# Altium schematic sheet SENSORS.SchDoc
size A4
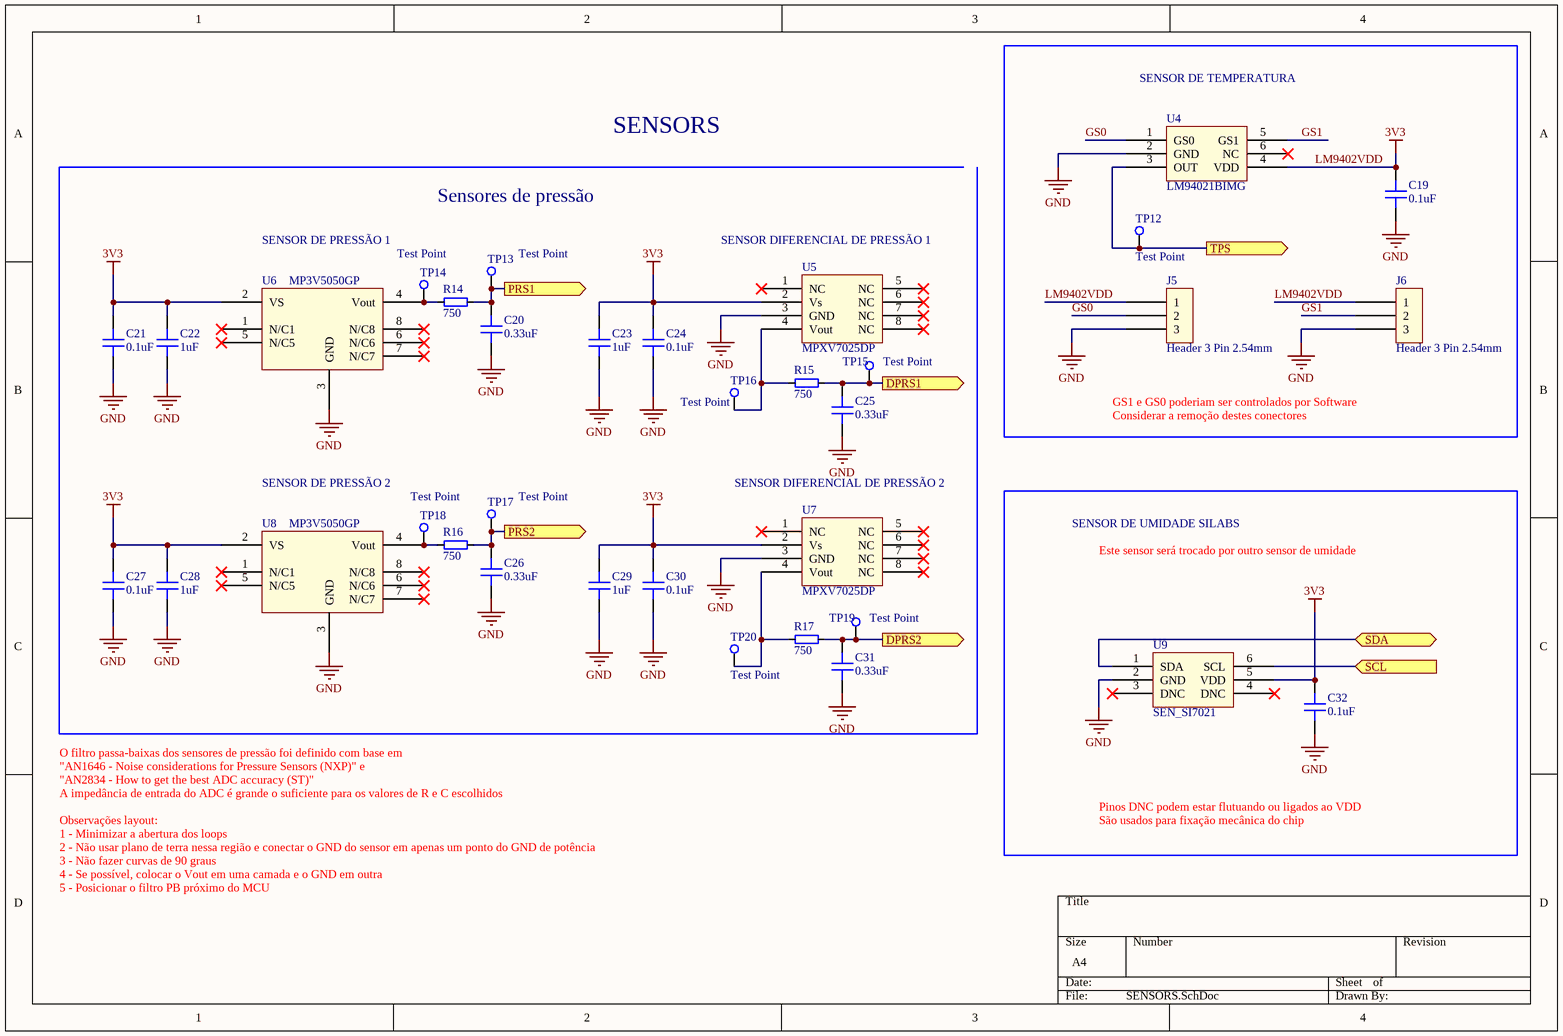
[diagram p0: SENSORS.SchDoc]

## Parts
C19  0.1uF  [C_0805]
C20  0.33uF  [C_0805]
C21  0.1uF  [C_0805]
C22  1uF  [C_0805]
C23  1uF  [C_0805]
C24  0.1uF  [C_0805]
C25  0.33uF  [C_0805]
C26  0.33uF  [C_0805]
C27  0.1uF  [C_0805]
C28  1uF  [C_0805]
C29  1uF  [C_0805]
C30  0.1uF  [C_0805]
C31  0.33uF  [C_0805]
C32  0.1uF  [C_0805]
J5  Header 3 Pin 2.54mm  [Header 3 Pin 2.54mm]
J6  Header 3 Pin 2.54mm  [Header 3 Pin 2.54mm]
R14  750  [R_0805]
R15  750  [R_0805]
R16  750  [R_0805]
R17  750  [R_0805]
TP12  Test Point  [Test_Point]
TP13  Test Point  [Test_Point]
TP14  Test Point  [Test_Point]
TP15  Test Point  [Test_Point]
TP16  Test Point  [Test_Point]
TP17  Test Point  [Test_Point]
TP18  Test Point  [Test_Point]
TP19  Test Point  [Test_Point]
TP20  Test Point  [Test_Point]
U4  LM94021BIMG  [LM94021BIMG]
U5  MPXV7025DP  [MPXV7025DP]
U6  MP3V5050GP  [MP3V5050GP]
U7  MPXV7025DP  [MPXV7025DP]
U8  MP3V5050GP  [MP3V5050GP]
U9  SEN_SI7021  [SI7021_6DFN]

## Ports
DPRS1 (out), DPRS2 (out), PRS1 (out), PRS2 (out), SCL (in), SDA (bidir), TPS (out)

## Nets
GND: C19.1 C20.1 C21.1 C22.1 C23.1 C24.1 C25.1 C26.1 C27.1 C28.1 C29.1 C30.1 C31.1 C32.1 J5.3 J6.3 U4.2(GND) U5.3(GND) U6.3(GND) U7.3(GND) U8.3(GND) U9.2(GND)
LM9402VDD: C19.2 C21.2 C22.2 C23.2 C24.2 C27.2 C28.2 C29.2 C30.2 C32.2 J5.1 J6.1 U4.4(VDD) U5.2(Vs) U6.2(VS) U7.2(Vs) U8.2(VS) U9.5(VDD)  [also labelled 3V3]
DPRS1: C25.2 R15.2 TP15.1(TP) ; port DPRS1
DPRS2: C31.2 R17.2 TP19.1(TP) ; port DPRS2
GS0: J5.2 U4.1(GS0)
GS1: J6.2 U4.5(GS1)
PRS1: C20.2 R14.2 TP13.1(TP) ; port PRS1
PRS2: C26.2 R16.2 TP17.1(TP) ; port PRS2
SCL: U9.6(SCL) ; port SCL
SDA: U9.1(SDA) ; port SDA
TPS: TP12.1(TP) U4.3(OUT) ; port TPS
NetR14_1: R14.1 TP14.1(TP) U6.4(Vout)
NetR15_1: R15.1 TP16.1(TP) U5.4(Vout)
NetR16_1: R16.1 TP18.1(TP) U8.4(Vout)
NetR17_1: R17.1 TP20.1(TP) U7.4(Vout)

Not connected (* = marked no-connect by the designer): U4 6(NC)*; U5 1(NC)* 5(NC)* 6(NC)* 7(NC)* 8(NC)*; U6 1(N/C1)* 5(N/C5)* 6(N/C6)* 7(N/C7)* 8(N/C8)*; U7 1(NC)* 5(NC)* 6(NC)* 7(NC)* 8(NC)*; U8 1(N/C1)* 5(N/C5)* 6(N/C6)* 7(N/C7)* 8(N/C8)*; U9 3(DNC)* 4(DNC)*

## Notes on the sheet
- SENSOR DE TEMPERATURA
- SENSORS
- SENSOR DE PRESSÃO 1
- Sensores de pressão
- (near U5) SENSOR DIFERENCIAL DE PRESSÃO 1
- GS1 e GS0 poderiam ser controlados por Software
- Considerar a remoção destes conectores
- SENSOR DE PRESSÃO 2
- SENSOR DIFERENCIAL DE PRESSÃO 2
- SENSOR DE UMIDADE SILABS
- Este sensor será trocado por outro sensor de umidade
- O filtro passa-baixas dos sensores de pressão foi definido com base em
- "AN1646 - Noise considerations for Pressure Sensors (NXP)" e
- "AN2834 - How to get the best ADC accuracy (ST)"
- A impedância de entrada do ADC é grande o suficiente para os valores de R e C escolhidos
- Observações layout:
- 1 - Minimizar a abertura dos loops
- 2 - Não usar plano de terra nessa região e conectar o GND do sensor em apenas um ponto do GND de potência
- Pinos DNC podem estar flutuando ou ligados ao VDD
- São usados para fixação mecânica do chip
- 3 - Não fazer curvas de 90 graus
- 4 - Se possível, colocar o Vout em uma camada e o GND em outra
- 5 - Posicionar o filtro PB próximo do MCU

## Library data of the parts
C19 C21 C24 C27 C30 C32 = C_0805_C0805C104K5RAC7411: SMD/SMT 50V 0.1uF X7R 0805 10% Ceramic; Manufacturer: KEMET; Value: 0.1uF; Voltage: 50V; Datasheet: https://www.mouser.in/datasheet/2/212/KEM_C1002_X7R_SMD-1102033.pdf; Supplier: https://www.mouser.in/ProductDetail/KEMET/C0805C104K5RAC7411?qs=sGAEpiMZZMukHu%252BjC5l7YUy%2FB4dg%2FhTABr7B0xlsxU8%3D; Temperature: -55 to +125ºC; Part Number: C0805C104K5RAC7411
C20 C25 C26 C31 = C_0805_C0805C334K5RECTU: SMD/SMT 50V 0.33uF X7R 0805 10%; Manufacturer: KEMET; Value: 0.33uF; Voltage: 50V; Datasheet: https://br.mouser.com/datasheet/2/212/KEM_C1090_X7R_ESD-1103328.pdf; Supplier: https://br.mouser.com/ProductDetail/KEMET/C0805C334K5RECTU?qs=sGAEpiMZZMukHu%252BjC5l7YW4TDpT9cCWZSWBJF89q8JI%3D; Temperature: -55 to +125ºC; Part Number: C0805C334K5RECTU
C22 C23 C28 C29 = C_0805_UMF212B7105KGHT: SMD/SMT 0805 50V 1uF 10% AEC-Q200 Ceramic; Manufacturer: Taiyo Yuden; Value: 1uF; Voltage: 50V; Datasheet: https://www.mouser.in/datasheet/2/396/taiyo_yuden_07182019_MLCC_AECQ200_Grade_1_X7R_data-1622917.pdf; Supplier: https://www.mouser.in/ProductDetail/Taiyo-Yuden/UMF212B7105KGHT?qs=sGAEpiMZZMukHu%252BjC5l7YbZJogKwR3uAsvk8LFV85oI%3D; Temperature: -55 to 125ºC; Part Number: UMF212B7105KGHT
R14-R17 = R_0805_ERJ-ERJ-6GEYJ751V: SMD 0805 750 OHM 5% AEC-Q200; Manufacturer: Panasonic; Voltage: 150V; Value: 750; Supplier: https://br.mouser.com/ProductDetail/Panasonic/ERJ-6GEYJ751V?qs=%2Fha2pyFaduiXHwl36i8QX0hu09VIkjbS%252B7Un%252BBpYHaXMOPUjNj5d7Q%3D%3D; Datasheet: https://br.mouser.com/datasheet/2/315/AOA0000C301-1488782.pdf; Temperature: -55 to +155ºC; Part Number: ERJ-6GEYJ751V
U4 = SEN_LM94021BIMG: IC TEMP SENSOR MULTI-GAIN SC70-5; Part Number: LM94021BIMG; Datasheet: http://www.ti.com/general/docs/suppproductinfo.tsp?distId=26&gotoUrl=http%3A%2F%2Fwww.ti.com%2Flit%2Fgpn%2Flm94021; Supplier: https://br.mouser.com/ProductDetail/Texas-Instruments/LM94021BIMG-NOPB?qs=QbsRYf82W3Gamc2uDn7DIw%3D%3D
U5 U7 = SEN_MPXV7025DP: -25 to 25 kPa Differential Pressure Sensor DUAL PORT 8-SOP; Part Number: MPXV7025DP; Datasheet: https://br.mouser.com/datasheet/2/302/MPXV7025-1127333.pdf; Supplier: https://br.mouser.com/ProductDetail/NXP-Semiconductors/MPXV7025DP?qs=r8OyiFxb6ReyFzMvnwyjmg%3D%3D
U6 U8 = SEN_MP3V5050GP: IC PRESSURE SENSOR 8-SOP 7PSI; Part Number: MP3V5050GP; Datasheet: https://br.mouser.com/datasheet/2/302/MP3V5050-1127012.pdf; Supplier: https://br.mouser.com/ProductDetail/NXP-Semiconductors/MP3V5050GP?qs=H%252BP%2FcHWii3cfygLO%2FUxqlg%3D%3D
U9 = SEN_SI7021: Humidity Sensors Digital RH ( 3% max) & temperature sensor, commercial grade with cover/filter; Supplier: https://br.mouser.com/ProductDetail/Silicon-Labs/SI7021-A20-GM1R?qs=sGAEpiMZZMsB9HsreUc%252BiUv%2FuYCFaXZo1mgPtJm187g%3D; Datasheet: https://br.mouser.com/datasheet/2/368/Si7021-A20-1397917.pdf
J5 J6 = Header 3 Pin 2.54mm: Datasheet: https://br.mouser.com/datasheet/2/276/0022285033_PCB_HEADERS-159031.pdf; Supplier: https://br.mouser.com/ProductDetail/Molex/22-28-5033?qs=sGAEpiMZZMs%252BGHln7q6pmxD%2F5kNJnZVepHUluVJbZ54%3D